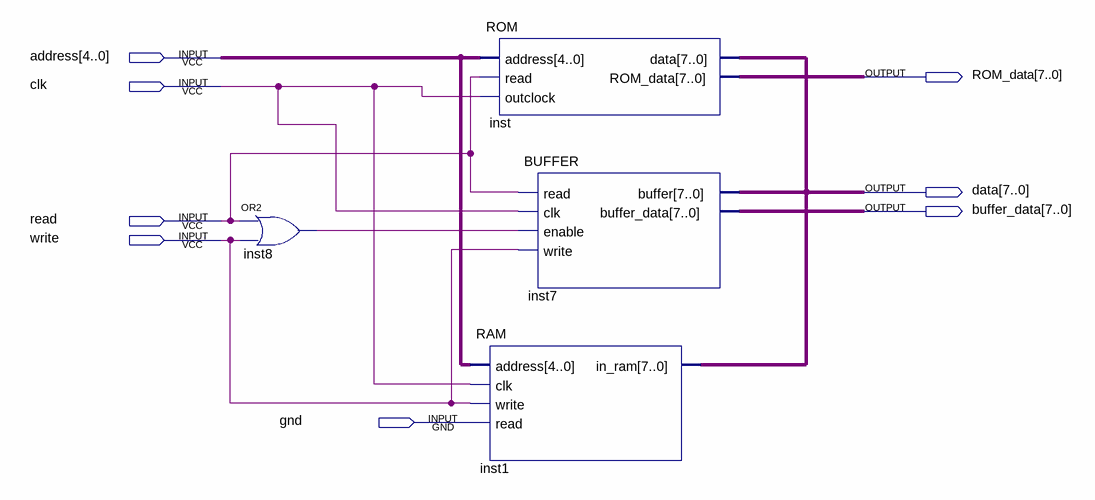
[diagram p0: schematic sheet]
// Quartus schematic lab4.bdf as structural Verilog: 4 symbols, 8 pins
module lab4 (
  input  [4:0] address,
  input  clk,
  input  read,
  input  write,
  input  gnd,
  output [7:0] ROM_data,
  output [7:0] data,
  output [7:0] buffer_data
);

  wire inst8_out;

  or inst8 (inst8_out, read, write);
  ROM inst (.address(address), .read(read), .outclock(clk), .data(data), .ROM_data(ROM_data));
  RAM inst1 (.address(address), .clk(clk), .write(write), .read(gnd), .in_ram(data));
  BUFFER inst7 (.read(read), .clk(clk), .enable(inst8_out), .write(write), .buffer(data), .buffer_data(buffer_data));
endmodule
